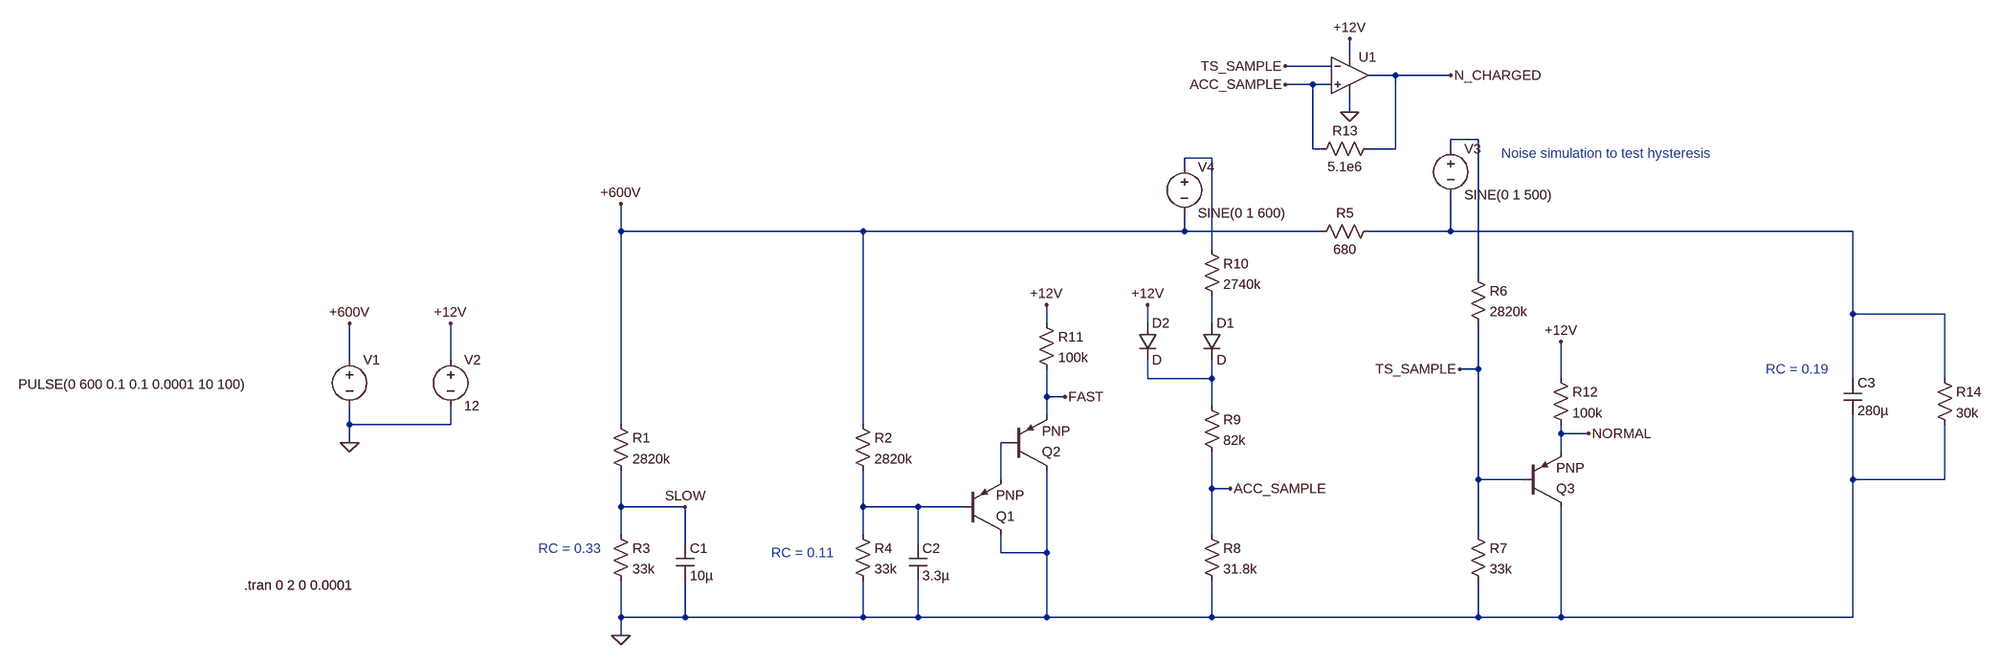
[diagram p0: schematic measurement.asc]
measurement.asc, the LTspice schematic file:
Version 4
SHEET 1 2404 680
WIRE 1296 -352 1296 -384
WIRE 1264 -336 1184 -336
WIRE 1376 -320 1328 -320
WIRE 1472 -320 1376 -320
WIRE 1232 -304 1184 -304
WIRE 1264 -304 1232 -304
WIRE 1296 -256 1296 -288
WIRE 1520 -208 1472 -208
WIRE 1232 -192 1232 -304
WIRE 1248 -192 1232 -192
WIRE 1376 -192 1376 -320
WIRE 1376 -192 1328 -192
WIRE 1472 -192 1472 -208
WIRE 1056 -176 1008 -176
WIRE 1008 -160 1008 -176
WIRE -192 -48 -192 -96
WIRE 448 -48 -192 -48
WIRE 1008 -48 1008 -80
WIRE 1008 -48 448 -48
WIRE 1248 -48 1008 -48
WIRE 1472 -48 1472 -112
WIRE 1472 -48 1328 -48
WIRE 2176 -48 1472 -48
WIRE 1056 -16 1056 -176
WIRE 1520 32 1520 -208
WIRE 2176 96 2176 -48
WIRE 2336 96 2176 96
WIRE 768 112 768 80
WIRE 944 112 944 80
WIRE 1056 112 1056 64
WIRE -928 176 -928 112
WIRE -752 176 -752 112
WIRE 1520 192 1520 112
WIRE 1520 192 1488 192
WIRE 944 208 944 176
WIRE 1056 208 1056 176
WIRE 1056 208 944 208
WIRE 1664 208 1664 144
WIRE 2176 208 2176 96
WIRE 2336 208 2336 96
WIRE 768 240 768 192
WIRE 800 240 768 240
WIRE 1056 256 1056 208
WIRE 768 272 768 240
WIRE -928 288 -928 256
WIRE -752 288 -752 256
WIRE -752 288 -928 288
WIRE -192 288 -192 -48
WIRE 448 288 448 -48
WIRE 1664 304 1664 288
WIRE 1712 304 1664 304
WIRE -928 320 -928 288
WIRE 704 320 688 320
WIRE 1664 336 1664 304
WIRE 688 384 688 320
WIRE 1520 384 1520 192
WIRE 1600 384 1520 384
WIRE 2176 384 2176 272
WIRE 2336 384 2336 288
WIRE 2336 384 2176 384
WIRE 1056 400 1056 336
WIRE 1088 400 1056 400
WIRE -192 432 -192 368
WIRE -80 432 -192 432
WIRE 448 432 448 368
WIRE 544 432 448 432
WIRE 624 432 544 432
WIRE -192 480 -192 432
WIRE 448 480 448 432
WIRE 1056 480 1056 400
WIRE 1520 480 1520 384
WIRE -80 496 -80 432
WIRE 544 496 544 432
WIRE 688 512 688 480
WIRE 768 512 768 368
WIRE 768 512 688 512
WIRE -192 624 -192 560
WIRE -80 624 -80 560
WIRE -80 624 -192 624
WIRE 448 624 448 560
WIRE 448 624 -80 624
WIRE 544 624 544 560
WIRE 544 624 448 624
WIRE 768 624 768 512
WIRE 768 624 544 624
WIRE 1056 624 1056 560
WIRE 1056 624 768 624
WIRE 1520 624 1520 560
WIRE 1520 624 1056 624
WIRE 1664 624 1664 432
WIRE 1664 624 1520 624
WIRE 2176 624 2176 384
WIRE 2176 624 1664 624
WIRE -192 656 -192 624
FLAG -192 656 0
FLAG -192 -96 +600V
FLAG -928 112 +600V
FLAG -928 320 0
FLAG 768 80 +12V
FLAG 944 80 +12V
FLAG 1664 144 +12V
FLAG -752 112 +12V
FLAG -80 432 SLOW
FLAG 800 240 FAST
FLAG 1712 304 NORMAL
FLAG 1088 400 ACC_SAMPLE
FLAG 1488 192 TS_SAMPLE
FLAG 1296 -256 0
FLAG 1296 -384 +12V
FLAG 1184 -304 ACC_SAMPLE
FLAG 1184 -336 TS_SAMPLE
FLAG 1472 -320 N_CHARGED
SYMBOL cap -96 496 R0
SYMATTR InstName C1
SYMATTR Value 10µ
SYMBOL cap 528 496 R0
SYMATTR InstName C2
SYMATTR Value 3.3µ
SYMBOL res -208 272 R0
SYMATTR InstName R1
SYMATTR Value 2820k
SYMBOL res 432 272 R0
SYMATTR InstName R2
SYMATTR Value 2820k
SYMBOL res -208 464 R0
SYMATTR InstName R3
SYMATTR Value 33k
SYMBOL res 432 464 R0
SYMATTR InstName R4
SYMATTR Value 33k
SYMBOL cap 2160 208 R0
SYMATTR InstName C3
SYMATTR Value 280µ
SYMBOL res 1504 16 R0
SYMATTR InstName R6
SYMATTR Value 2820k
SYMBOL res 1504 464 R0
SYMATTR InstName R7
SYMATTR Value 33k
SYMBOL voltage -928 160 R0
WINDOW 3 -577 58 Left 2
WINDOW 123 0 0 Left 0
WINDOW 39 0 0 Left 0
SYMATTR Value PULSE(0 600 0.1 0.1 0.0001 10 100)
SYMATTR InstName V1
SYMBOL pnp 624 480 M180
SYMATTR InstName Q1
SYMBOL pnp 704 368 M180
SYMATTR InstName Q2
SYMBOL pnp 1600 432 M180
SYMATTR InstName Q3
SYMBOL res 1040 464 R0
SYMATTR InstName R8
SYMATTR Value 31.8k
SYMBOL res 1040 240 R0
SYMATTR InstName R9
SYMATTR Value 82k
SYMBOL res 1040 -32 R0
SYMATTR InstName R10
SYMATTR Value 2740k
SYMBOL diode 1040 112 R0
SYMATTR InstName D1
SYMBOL diode 928 112 R0
SYMATTR InstName D2
SYMBOL res 752 96 R0
SYMATTR InstName R11
SYMATTR Value 100k
SYMBOL res 1648 192 R0
SYMATTR InstName R12
SYMATTR Value 100k
SYMBOL voltage -752 160 R0
WINDOW 123 0 0 Left 0
WINDOW 39 0 0 Left 0
SYMATTR InstName V2
SYMATTR Value 12
SYMBOL res 1344 -64 R90
WINDOW 0 0 56 VBottom 2
WINDOW 3 32 56 VTop 2
SYMATTR InstName R5
SYMATTR Value 680
SYMBOL OpAmps\\UniversalOpamp2 1296 -320 R0
SYMATTR InstName U1
SYMBOL res 1344 -208 R90
WINDOW 0 0 56 VBottom 2
WINDOW 3 32 56 VTop 2
SYMATTR InstName R13
SYMATTR Value 5.1e6
SYMBOL voltage 1472 -208 R0
WINDOW 123 0 0 Left 0
WINDOW 39 0 0 Left 0
SYMATTR InstName V3
SYMATTR Value SINE(0 1 500)
SYMBOL voltage 1008 -176 R0
WINDOW 123 0 0 Left 0
WINDOW 39 0 0 Left 0
SYMATTR InstName V4
SYMATTR Value SINE(0 1 600)
SYMBOL res 2320 192 R0
SYMATTR InstName R14
SYMATTR Value 30k
TEXT -336 504 Left 2 ;RC = 0.33
TEXT 288 512 Left 2 ;RC = 0.11
TEXT -1112 568 Left 2 !.tran 0 2 0 0.0001
TEXT 2024 192 Left 2 ;RC = 0.19
TEXT 1560 -184 Left 2 ;Noise simulation to test hysteresis

The netlist it stands for:
* measurement.asc
C1 SLOW 0 10µ
C2 N007 0 3.3µ
R1 +600V SLOW 2820k
R2 +600V N007 2820k
R3 SLOW 0 33k
R4 N007 0 33k
C3 N003 0 280µ
R6 N001 TS_SAMPLE 2820k
R7 TS_SAMPLE 0 33k
V1 +600V 0 PULSE(0 600 0.1 0.1 0.0001 10 100)
Q1 0 N007 N006 0 PNP
Q2 0 N006 FAST 0 PNP
Q3 0 TS_SAMPLE NORMAL 0 PNP
R8 ACC_SAMPLE 0 31.8k
R9 N005 ACC_SAMPLE 82k
R10 N002 N004 2740k
D1 N004 N005 D
D2 +12V N005 D
R11 +12V FAST 100k
R12 +12V NORMAL 100k
V2 +12V 0 12
R5 N003 +600V 680
XU1 ACC_SAMPLE TS_SAMPLE +12V 0 N_CHARGED level.2 Avol=1Meg GBW=10Meg Slew=10Meg ilimit=25m rail=0 Vos=0 phimargin=45 en=0 enk=0 in=0 ink=0 Rin=500Meg  ; pins IN+ IN- V+ V- OUT
R13 N_CHARGED ACC_SAMPLE 5.1e6
V3 N001 N003 SINE(0 1 500)
V4 N002 +600V SINE(0 1 600)
R14 N003 0 30k
.model D D
.lib standard.dio
.model NPN NPN
.model PNP PNP
.lib standard.bjt
* RC = 0.33
* RC = 0.11
.tran 0 2 0 0.0001
* RC = 0.19
* Noise simulation to test hysteresis
.lib UniversalOpamps2.sub
.backanno
.end